# Altium schematic sheet Cell+Balancing_Interface.SchDoc: Title
size B; Organization: Midnight Sun Solar Rayce Car Team; Address1: University of Waterloo; Address2: 200 University Ave W; Address3: Waterloo, ON, Canada; Address4: N2L 3E9; Website: www.uwmidsun.com; ProjectName: ProjectName
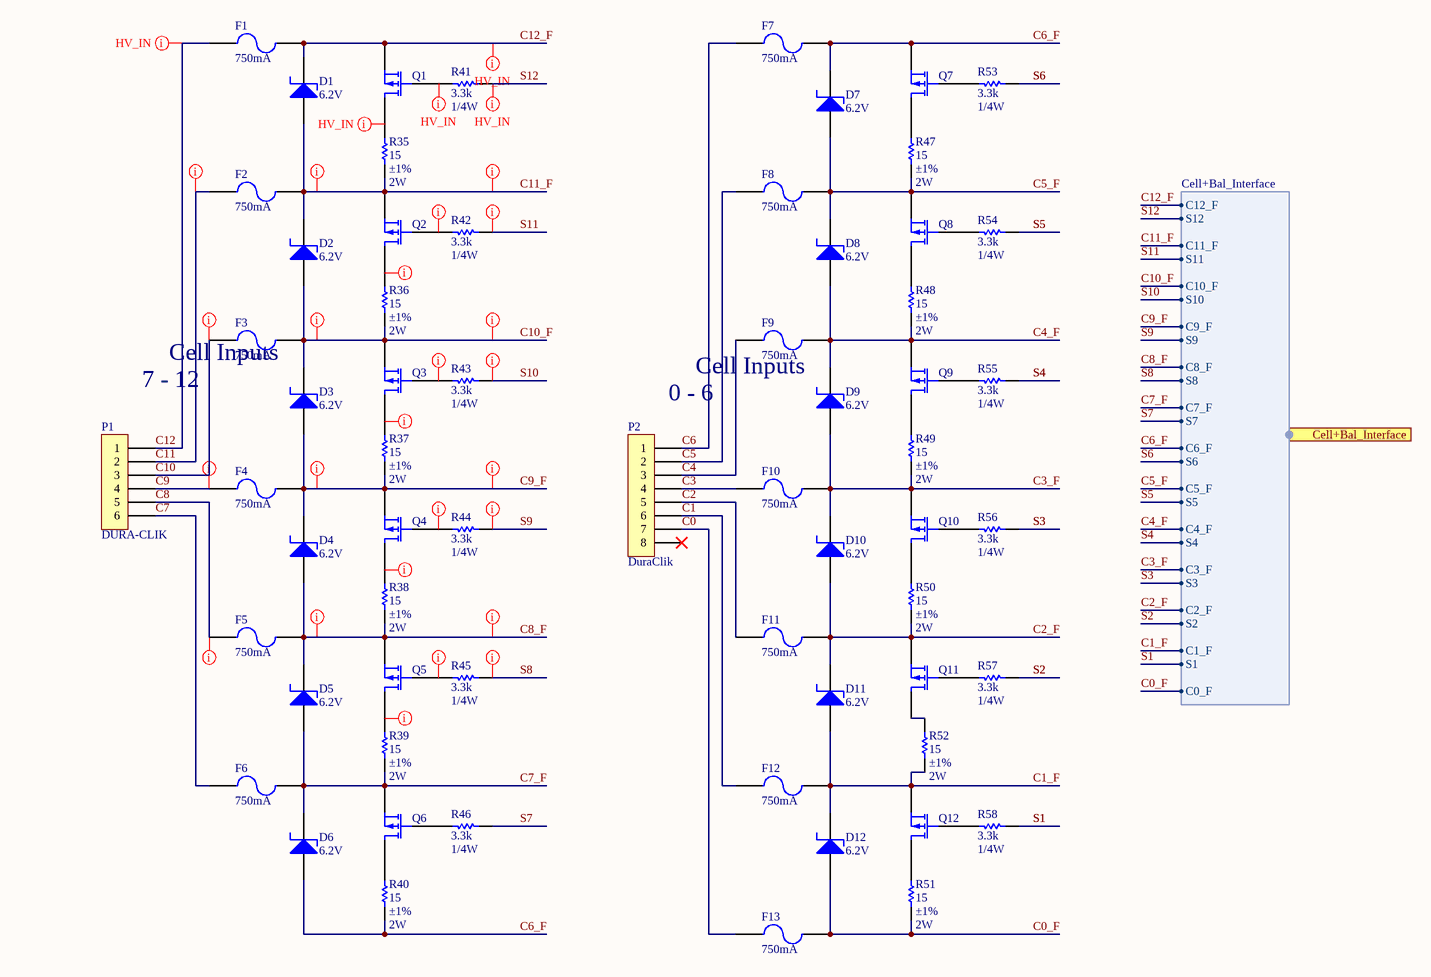
[diagram p0: Cell+Balancing_Interface.SchDoc]

## Parts
D1  Voltage - Zener (Nom): 6.2V  [DO-214AA Diode]  (hidden comment: DIODE ZENER 6.2V 5W DO214AA)
D2  Voltage - Zener (Nom): 6.2V  [DO-214AA Diode]  (hidden comment: DIODE ZENER 6.2V 5W DO214AA)
D3  Voltage - Zener (Nom): 6.2V  [DO-214AA Diode]  (hidden comment: DIODE ZENER 6.2V 5W DO214AA)
D4  Voltage - Zener (Nom): 6.2V  [DO-214AA Diode]  (hidden comment: DIODE ZENER 6.2V 5W DO214AA)
D5  Voltage - Zener (Nom): 6.2V  [DO-214AA Diode]  (hidden comment: DIODE ZENER 6.2V 5W DO214AA)
D6  Voltage - Zener (Nom): 6.2V  [DO-214AA Diode]  (hidden comment: DIODE ZENER 6.2V 5W DO214AA)
D7  Voltage - Zener (Nom): 6.2V  [DO-214AA Diode]  (hidden comment: DIODE ZENER 6.2V 5W DO214AA)
D8  Voltage - Zener (Nom): 6.2V  [DO-214AA Diode]  (hidden comment: DIODE ZENER 6.2V 5W DO214AA)
D9  Voltage - Zener (Nom): 6.2V  [DO-214AA Diode]  (hidden comment: DIODE ZENER 6.2V 5W DO214AA)
D10  Voltage - Zener (Nom): 6.2V  [DO-214AA Diode]  (hidden comment: DIODE ZENER 6.2V 5W DO214AA)
D11  Voltage - Zener (Nom): 6.2V  [DO-214AA Diode]  (hidden comment: DIODE ZENER 6.2V 5W DO214AA)
D12  Voltage - Zener (Nom): 6.2V  [DO-214AA Diode]  (hidden comment: DIODE ZENER 6.2V 5W DO214AA)
F1  Current Rating: 750mA  [RES, 0603]  (hidden comment: FUSE SMT 750MA)
F2  Current Rating: 750mA  [RES, 0603]  (hidden comment: FUSE SMT 750MA)
F3  Current Rating: 750mA  [RES, 0603]  (hidden comment: FUSE SMT 750MA)
F4  Current Rating: 750mA  [RES, 0603]  (hidden comment: FUSE SMT 750MA)
F5  Current Rating: 750mA  [RES, 0603]  (hidden comment: FUSE SMT 750MA)
F6  Current Rating: 750mA  [RES, 0603]  (hidden comment: FUSE SMT 750MA)
F7  Current Rating: 750mA  [RES, 0603]  (hidden comment: FUSE SMT 750MA)
F8  Current Rating: 750mA  [RES, 0603]  (hidden comment: FUSE SMT 750MA)
F9  Current Rating: 750mA  [RES, 0603]  (hidden comment: FUSE SMT 750MA)
F10  Current Rating: 750mA  [RES, 0603]  (hidden comment: FUSE SMT 750MA)
F11  Current Rating: 750mA  [RES, 0603]  (hidden comment: FUSE SMT 750MA)
F12  Current Rating: 750mA  [RES, 0603]  (hidden comment: FUSE SMT 750MA)
F13  Current Rating: 750mA  [RES, 0603]  (hidden comment: FUSE SMT 750MA)
P1  DURA-CLIK  [CONN, 6POS DURA-CLIK VERT]
P2  Series: DuraClik  [CONN, 8POS Dura-Clik]  (hidden comment: CONN 8POS DURA-CLIK 0.079")
Q1  MOSFET P-CH 16V 2.5A X2-DFN2015  [DFN86P197X40-3N]  (value not drawn)
Q2  MOSFET P-CH 16V 2.5A X2-DFN2015  [DFN86P197X40-3N]  (value not drawn)
Q3  MOSFET P-CH 16V 2.5A X2-DFN2015  [DFN86P197X40-3N]  (value not drawn)
Q4  MOSFET P-CH 16V 2.5A X2-DFN2015  [DFN86P197X40-3N]  (value not drawn)
Q5  MOSFET P-CH 16V 2.5A X2-DFN2015  [DFN86P197X40-3N]  (value not drawn)
Q6  MOSFET P-CH 16V 2.5A X2-DFN2015  [DFN86P197X40-3N]  (value not drawn)
Q7  MOSFET P-CH 16V 2.5A X2-DFN2015  [DFN86P197X40-3N]  (value not drawn)
Q8  MOSFET P-CH 16V 2.5A X2-DFN2015  [DFN86P197X40-3N]  (value not drawn)
Q9  MOSFET P-CH 16V 2.5A X2-DFN2015  [DFN86P197X40-3N]  (value not drawn)
Q10  MOSFET P-CH 16V 2.5A X2-DFN2015  [DFN86P197X40-3N]  (value not drawn)
Q11  MOSFET P-CH 16V 2.5A X2-DFN2015  [DFN86P197X40-3N]  (value not drawn)
Q12  MOSFET P-CH 16V 2.5A X2-DFN2015  [DFN86P197X40-3N]  (value not drawn)
R35  Resistance: 15  Tolerance: ±1%  Power: 2W  [RES2512]  (hidden comment: RES 15 OHM 1% 2W 2512)
R36  Resistance: 15  Tolerance: ±1%  Power: 2W  [RES2512]  (hidden comment: RES 15 OHM 1% 2W 2512)
R37  Resistance: 15  Tolerance: ±1%  Power: 2W  [RES2512]  (hidden comment: RES 15 OHM 1% 2W 2512)
R38  Resistance: 15  Tolerance: ±1%  Power: 2W  [RES2512]  (hidden comment: RES 15 OHM 1% 2W 2512)
R39  Resistance: 15  Tolerance: ±1%  Power: 2W  [RES2512]  (hidden comment: RES 15 OHM 1% 2W 2512)
R40  Resistance: 15  Tolerance: ±1%  Power: 2W  [RES2512]  (hidden comment: RES 15 OHM 1% 2W 2512)
R41  Resistance: 3.3k  Power: 1/4W  [RES, 0603]  (hidden comment: RES 3.3K OHM 1% 1/4W 0603)
R42  Resistance: 3.3k  Power: 1/4W  [RES, 0603]  (hidden comment: RES 3.3K OHM 1% 1/4W 0603)
R43  Resistance: 3.3k  Power: 1/4W  [RES, 0603]  (hidden comment: RES 3.3K OHM 1% 1/4W 0603)
R44  Resistance: 3.3k  Power: 1/4W  [RES, 0603]  (hidden comment: RES 3.3K OHM 1% 1/4W 0603)
R45  Resistance: 3.3k  Power: 1/4W  [RES, 0603]  (hidden comment: RES 3.3K OHM 1% 1/4W 0603)
R46  Resistance: 3.3k  Power: 1/4W  [RES, 0603]  (hidden comment: RES 3.3K OHM 1% 1/4W 0603)
R47  Resistance: 15  Tolerance: ±1%  Power: 2W  [RES2512]  (hidden comment: RES 15 OHM 1% 2W 2512)
R48  Resistance: 15  Tolerance: ±1%  Power: 2W  [RES2512]  (hidden comment: RES 15 OHM 1% 2W 2512)
R49  Resistance: 15  Tolerance: ±1%  Power: 2W  [RES2512]  (hidden comment: RES 15 OHM 1% 2W 2512)
R50  Resistance: 15  Tolerance: ±1%  Power: 2W  [RES2512]  (hidden comment: RES 15 OHM 1% 2W 2512)
R51  Resistance: 15  Tolerance: ±1%  Power: 2W  [RES2512]  (hidden comment: RES 15 OHM 1% 2W 2512)
R52  Resistance: 15  Tolerance: ±1%  Power: 2W  [RES2512]  (hidden comment: RES 15 OHM 1% 2W 2512)
R53  Resistance: 3.3k  Power: 1/4W  [RES, 0603]  (hidden comment: RES 3.3K OHM 1% 1/4W 0603)
R54  Resistance: 3.3k  Power: 1/4W  [RES, 0603]  (hidden comment: RES 3.3K OHM 1% 1/4W 0603)
R55  Resistance: 3.3k  Power: 1/4W  [RES, 0603]  (hidden comment: RES 3.3K OHM 1% 1/4W 0603)
R56  Resistance: 3.3k  Power: 1/4W  [RES, 0603]  (hidden comment: RES 3.3K OHM 1% 1/4W 0603)
R57  Resistance: 3.3k  Power: 1/4W  [RES, 0603]  (hidden comment: RES 3.3K OHM 1% 1/4W 0603)
R58  Resistance: 3.3k  Power: 1/4W  [RES, 0603]  (hidden comment: RES 3.3K OHM 1% 1/4W 0603)

## Ports
Cell+Bal_Interface (harness Cell+Bal_Interface)

## Harnesses
Cell+Bal_Interface: C12_F, C11_F, C10_F, C9_F, C8_F, C7_F, C6_F, C5_F, C4_F, C3_F, C2_F, C1_F, C0_F, S1, S2, S3, S4, S5, S6, S7, S8, S9, S10, S11, S12

## Nets
C0: F13.1 P2.7
C0_F: D12.1(A) F13.2 R51.1 ; port Cell+Bal_Interface.C0_F
C1: F12.1 P2.6
C1_F: D11.1(A) D12.2(K) F12.2 Q12.2(S) R52.1 ; port Cell+Bal_Interface.C1_F
C2: F11.1 P2.5
C2_F: D10.1(A) D11.2(K) F11.2 Q11.2(S) R50.1 ; port Cell+Bal_Interface.C2_F
C3: F10.1 P2.4
C3_F: D9.1(A) D10.2(K) F10.2 Q10.2(S) R49.1 ; port Cell+Bal_Interface.C3_F
C4: F9.1 P2.3
C4_F: D8.1(A) D9.2(K) F9.2 Q9.2(S) R48.1 ; port Cell+Bal_Interface.C4_F
C5: F8.1 P2.2
C5_F: D7.1(A) D8.2(K) F8.2 Q8.2(S) R47.1 ; port Cell+Bal_Interface.C5_F
C6: F7.1 P2.1
C6_F: D6.1(A) D7.2(K) F7.2 Q7.2(S) R40.1 ; port Cell+Bal_Interface.C6_F
C7: F6.1 P1.6
C7_F: D5.1(A) D6.2(K) F6.2 Q6.2(S) R39.1 ; port Cell+Bal_Interface.C7_F
C8: F5.1 P1.5
C8_F: D4.1(A) D5.2(K) F5.2 Q5.2(S) R38.1 ; port Cell+Bal_Interface.C8_F
C9: F4.1 P1.4
C9_F: D3.1(A) D4.2(K) F4.2 Q4.2(S) R37.1 ; port Cell+Bal_Interface.C9_F
C10: F3.1 P1.3
C10_F: D2.1(A) D3.2(K) F3.2 Q3.2(S) R36.1 ; port Cell+Bal_Interface.C10_F
C11: F2.1 P1.2
C11_F: D1.1(A) D2.2(K) F2.2 Q2.2(S) R35.1 ; port Cell+Bal_Interface.C11_F
C12: F1.1 P1.1
C12_F: D1.2(K) F1.2 Q1.2(S) ; port Cell+Bal_Interface.C12_F
S1: R58.1 ; port Cell+Bal_Interface.S1
S2: R57.1 ; port Cell+Bal_Interface.S2
S3: R56.1 ; port Cell+Bal_Interface.S3
S4: R55.1 ; port Cell+Bal_Interface.S4
S5: R54.1 ; port Cell+Bal_Interface.S5
S6: R53.1 ; port Cell+Bal_Interface.S6
S7: R46.1 ; port Cell+Bal_Interface.S7
S8: R45.1 ; port Cell+Bal_Interface.S8
S9: R44.1 ; port Cell+Bal_Interface.S9
S10: R43.1 ; port Cell+Bal_Interface.S10
S11: R42.1 ; port Cell+Bal_Interface.S11
S12: R41.1 ; port Cell+Bal_Interface.S12
NetQ1_1: Q1.1(G) R41.2
NetQ1_3: Q1.3(D) R35.2
NetQ2_1: Q2.1(G) R42.2
NetQ2_3: Q2.3(D) R36.2
NetQ3_1: Q3.1(G) R43.2
NetQ3_3: Q3.3(D) R37.2
NetQ4_1: Q4.1(G) R44.2
NetQ4_3: Q4.3(D) R38.2
NetQ5_1: Q5.1(G) R45.2
NetQ5_3: Q5.3(D) R39.2
NetQ6_1: Q6.1(G) R46.2
NetQ6_3: Q6.3(D) R40.2
NetQ7_1: Q7.1(G) R53.2
NetQ7_3: Q7.3(D) R47.2
NetQ8_1: Q8.1(G) R54.2
NetQ8_3: Q8.3(D) R48.2
NetQ9_1: Q9.1(G) R55.2
NetQ9_3: Q9.3(D) R49.2
NetQ10_1: Q10.1(G) R56.2
NetQ10_3: Q10.3(D) R50.2
NetQ11_1: Q11.1(G) R57.2
NetQ11_3: Q11.3(D) R52.2
NetQ12_1: Q12.1(G) R58.2
NetQ12_3: Q12.3(D) R51.2

Not connected (* = marked no-connect by the designer): P2 8*

## Layout directives
net class HV_IN: C8, C8_F, C9, C9_F, C10, C10_F, C11, C11_F, C12, C12_F, NetQ1_1, NetQ1_3, NetQ2_1, NetQ2_3, NetQ3_1, NetQ3_3, NetQ4_1, NetQ4_3, NetQ5_1, NetQ5_3, S8, S9, S10, S11, S12

## Notes on the sheet
- 7 - 12
- Cell Inputs
- (near P2) 0 - 6
- PROJECT
- DOCUMENT
- DRAWN BY
- LAST MODIFIED
- PART NUMBER
- REVISION
- SHEET
- VARIANT
- OF
- Engineering 5 - 1002
  University of Waterloo
  (519) 888-4567 x32978
  hardware@uwmidsun.com

## Library data of the parts
D1-D12 = DIODE ZENER 6.2V 5W DO214AA: Zener Diode 6.2V 5W ±5% Surface Mount DO-214AA (SMB); Manufacturer 1: Micro Commercial Co; Manufacturer Part Number 1: SMBJ5341B-TP; Current - Reverse Leakage @ Vr: 1µA @ 3V; Voltage - Forward (Vf) (Max) @ If: 1.2V @ 1A; Supplier 1: Digi-Key; Supplier Part Number 1: SMBJ5341B-TPMSCT-ND; Packaging: Cut Tape (CT); Part Status: Active; Operating Temperature: -55°C ~ 150°C; Mounting Type: Surface Mount; Package / Case: DO-214AA, SMB; Supplier Device Package: DO-214AA (SMB); ComponentLink1URL: http://www.mccsemi.com/up_pdf/SMBJ5338B-SMBJ5388B(SMB).pdf; ComponentLink1Description: http://www.mccsemi.com/up_pdf/SMBJ5338B-SMBJ5388B(SMB).pdf; Tolerance: ±5%
F1-F13 = FUSE SMT 750MA: Board Mount Fuse 750MA 32VAC 63VDC; Manufacturer 1: Bel Fuse Inc.; Manufacturer Part Number 1: C2Q 750; Fuse Type: Board Mount (Cartridge Style Excluded); Response Time: Fast; Breaking Capacity @ Rated Voltage: 35A AC, 50A DC; Approvals: CE, cULus; Supplier 1: Digi-Key; Supplier Part Number 1: 507-1090-1-ND; Packaging: Cut Tape (CT); Part Status: Active; Package / Case: 0603 (1608 Metric); Mounting Type: Surface Mount; Operating Temperature: -55°C ~ 125°C; Color: -; Size / Dimension: 0.063" L x 0.032" W x 0.019" H (1.60mm x 0.82mm x 0.48mm); ComponentLink1URL: https://belfuse.com/resources/StewartConnector/C2Q.pdf; ComponentLink1Description: https://belfuse.com/resources/StewartConnector/C2Q.pdf
P1 = CONN 6POS DURA-CLIK 0.079": 6 Positions Header, Shrouded Connector 0.079" (2.00mm) Surface Mount, Vertical Tin; Manufacturer: Molex; Manufacturer Part Number: 5600200820; Style: Board to Cable/Wire; Shrouding: Shrouded - 4 Wall; Number of Positions: 6; Number of Positions Loaded: All; Mated Stacking Heights: 9.3mm; Supplier 1: Digi-Key; Supplier Part Number 1: WM10866CT-ND; RoHS: RoHS Compliant; Category: Connectors, Interconnects; Stock 1: 3826; Pricing 1: 1=1.76, 10=1.542, 25=1.4512, 50=1.391, 100=1.3305, 250=1.20956 (CAD); Packaging: Cut Tape (CT); Part Status: Active; Connector Type: Header; Contact Type: Male Pin; Pitch - Mating: 0.079" (2.00mm); Number of Rows: 1; Row Spacing - Mating: -; Mounting Type: Surface Mount; Termination: Solder; Fastening Type: Latch Lock; Contact Length - Mating: -; Contact Length - Post: -; Overall Contact Length: -; Insulation Height: 0.315" (8.00mm); Contact Shape: Square; Contact Finish - Mating: Tin; Contact Finish Thickness - Mating: -; Contact Finish - Post: Tin; Contact Material: Copper Alloy; Insulation Material: Polyamide (PA), Nylon; Features: Solder Retention; Operating Temperature: -; Ingress Protection: -; Material Flammability Rating: -; Insulation Color: Natural; Current Rating: -; Voltage Rating: -; Contact Finish Thickness - Post: -; Applications: Automotive, Industrial; ComponentLink1URL: http://www.molex.com/pdm_docs/sd/5600200220_sd.pdf; ComponentLink1Description: http://www.molex.com/pdm_docs/sd/5600200220_sd.pdf
P2 = CONN 8POS DURA-CLIK 0.079": 8 Positions Header Connector 0.079" (2.00mm) Surface Mount Tin; Manufacturer 1: Molex, LLC; Manufacturer Part Number 1: 5600200820; Style: Board to Cable/Wire; Shrouding: Shrouded - 4 Wall; Number of Positions: 8; Number of Positions Loaded: All; Mated Stacking Heights: 9.3mm; Supplier 1: Digi-Key; Supplier Part Number 1: WM10868CT-ND; Packaging: Cut Tape (CT); Part Status: Active; Connector Type: Header; Contact Type: Male Pin; Pitch - Mating: 0.079" (2.00mm); Number of Rows: 1; Row Spacing - Mating: -; Mounting Type: Surface Mount; Termination: Solder; Fastening Type: Latch Lock; Contact Length - Mating: -; Contact Length - Post: -; Overall Contact Length: -; Insulation Height: 0.315" (8.00mm); Contact Shape: Square; Contact Finish - Mating: Tin; Contact Finish Thickness - Mating: -; Contact Finish - Post: Tin; Contact Material: Copper Alloy; Insulation Material: Polyamide (PA), Nylon; Operating Temperature: -; Ingress Protection: -; Material Flammability Rating: -; Insulation Color: Natural; Current Rating: -; Contact Finish Thickness - Post: -; ComponentLink1URL: http://www.molex.com/pdm_docs/sd/5600200820_sd.pdf; ComponentLink1Description: http://www.molex.com/pdm_docs/sd/5600200820_sd.pdf; Voltage: -
Q1-Q12 = MOSFET P-CH 16V 2.5A X2-DFN2015: P-Channel 16V 2.5A (Ta) 650mW (Ta) Surface Mount X2-DFN2015-3; Manufacturer 1: Diodes Incorporated; Manufacturer Part Number 1: DMG3415UFY4Q-7; Drive Voltage (Max Rds On,  Min Rds On): 1.8V, 4.5V; Vgs(th) (Max) @ Id: 1V @ 250µA; Gate Charge (Qg) (Max) @ Vgs: 10nC @ 4.5V; Input Capacitance (Ciss) (Max) @ Vds: 282pF @ 10V; Vgs (Max): ±8V; Rds On (Max) @ Id, Vgs: 39 mOhm @ 4A, 4.5V; Supplier 1: Digi-Key; Supplier Part Number 1: DMG3415UFY4Q-7DICT-ND; Packaging: Cut Tape (CT); Part Status: Active; FET Type: P-Channel; Technology: MOSFET (Metal Oxide); Drain to Source Voltage (Vdss): 16V; Current - Continuous Drain (Id) @ 25°C: 2.5A (Ta); FET Feature: -; Power Dissipation (Max): 650mW (Ta); Operating Temperature: -55°C ~ 150°C (TJ); Mounting Type: Surface Mount; Supplier Device Package: X2-DFN2015-3; Package / Case: 3-XFDFN; ComponentLink1URL: https://www.diodes.com/assets/Datasheets/DMG3415UFY4Q.pdf; ComponentLink1Description: https://www.diodes.com/assets/Datasheets/DMG3415UFY4Q.pdf
R35-R40 R47-R52 = RES 15 OHM 1% 2W 2512: 15 Ohm ±1% 2W Chip Resistor 2512 (6432 Metric) Thick Film; Manufacturer 1: TE Connectivity Passive Product; Manufacturer Part Number 1: 352115RFT; Temperature Coefficient: ±100ppm/°C; Supplier 1: Digi-Key; Supplier Part Number 1: A115988CT-ND; Packaging: Cut Tape (CT); Part Status: Active; Composition: Thick Film; Operating Temperature: -55°C ~ 155°C; Package / Case: 2512 (6432 Metric); Supplier Device Package: -; Size / Dimension: 0.248" L x 0.126" W (6.30mm x 3.20mm); Height - Seated (Max): 0.026" (0.65mm); Failure Rate: -; ComponentLink1URL: http://www.te.com/commerce/DocumentDelivery/DDEController?Action=srchrtrv&DocNm=9-1773463-5&DocType=DS&DocLang=English; ComponentLink1Description: http://www.te.com/commerce/DocumentDelivery/DDEController?Action=srchrtrv&DocNm=9-1773463-5&DocType=DS&DocLang=English
R41-R46 R53-R58 = RES 3.3K OHM 1% 1/4W 0603: 3.3k Ohm ±1% 0.25W, 1/4W Chip Resistor 0603 (1608 Metric) Automotive AEC-Q200, Pulse Withstanding Thick Film; Manufacturer 1: Panasonic Electronic Components; Manufacturer Part Number 1: ERJ-PA3F3301V; Temperature Coefficient: ±100ppm/°C; Supplier 1: Digi-Key; Supplier Part Number 1: P3.3KBYCT-ND; Packaging: Cut Tape (CT); Part Status: Active; Composition: Thick Film; Operating Temperature: -55°C ~ 155°C; Package / Case: 0603 (1608 Metric); Supplier Device Package: 0603; Size / Dimension: 0.063" L x 0.031" W (1.60mm x 0.80mm); Height - Seated (Max): 0.022" (0.55mm); Failure Rate: -; ComponentLink1URL: https://industrial.panasonic.com/cdbs/www-data/pdf/RDO0000/AOA0000C291.pdf; ComponentLink1Description: https://industrial.panasonic.com/cdbs/www-data/pdf/RDO0000/AOA0000C291.pdf; Tolerance: ±1%